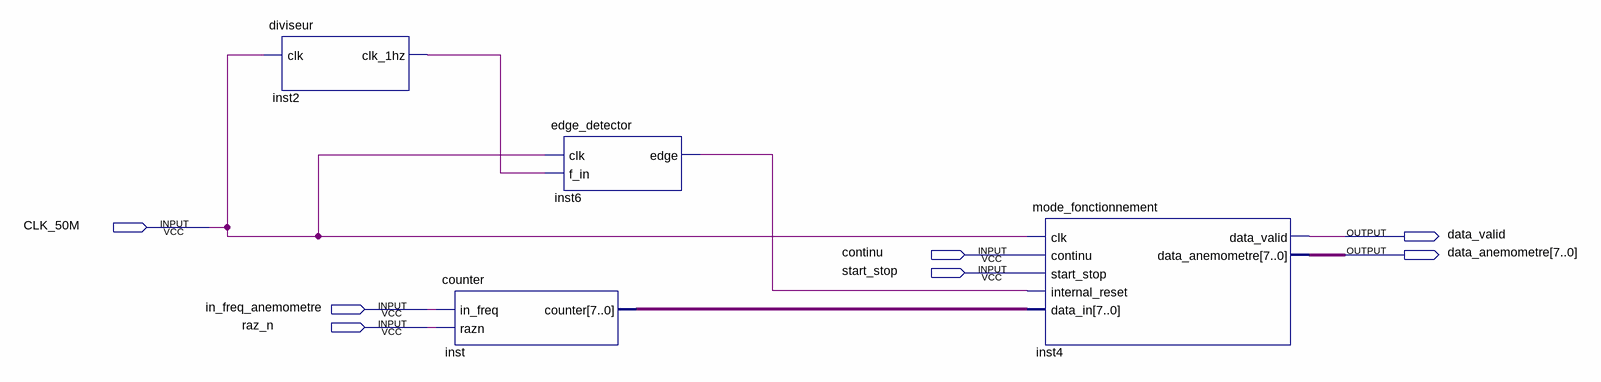
[diagram p0: schematic sheet]
// Quartus schematic Block1.bdf as structural Verilog: 4 symbols, 7 pins
module Block1 (
  input  CLK_50M,
  input  continu,
  input  start_stop,
  input  in_freq_anemometre,
  input  raz_n,
  output data_valid,
  output [7:0] data_anemometre
);

  wire inst2_clk_1hz, inst6_edge;
  wire [7:0] inst_counter;

  diviseur inst2 (.clk(CLK_50M), .clk_1hz(inst2_clk_1hz));
  counter inst (.in_freq(in_freq_anemometre), .razn(raz_n), .counter(inst_counter));
  edge_detector inst6 (.clk(CLK_50M), .f_in(inst2_clk_1hz), .\edge (inst6_edge));
  mode_fonctionnement inst4 (
    .clk(CLK_50M), .continu(continu), .start_stop(start_stop), .internal_reset(inst6_edge),
    .data_in(inst_counter), .data_valid(data_valid), .data_anemometre(data_anemometre));
endmodule
